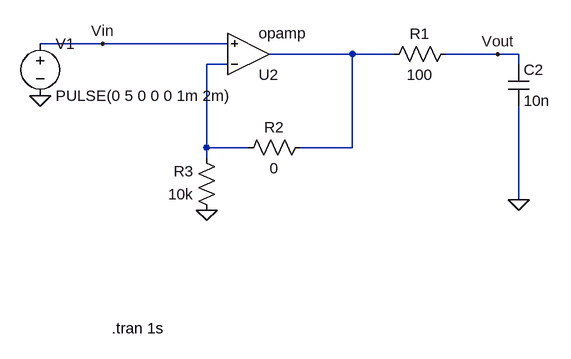
[diagram p0: schematic AnalogBuffer.asc]
AnalogBuffer.asc, the LTspice schematic file:
Version 4
SHEET 1 880 680
WIRE -128 -256 -224 -256
WIRE 64 -256 -128 -256
WIRE 256 -240 128 -240
WIRE 320 -240 256 -240
WIRE 480 -240 400 -240
WIRE 512 -240 480 -240
WIRE 64 -224 32 -224
WIRE 512 -224 512 -240
WIRE 32 -96 32 -224
WIRE 96 -96 32 -96
WIRE 256 -96 256 -240
WIRE 256 -96 176 -96
WIRE 32 -80 32 -96
WIRE 512 -16 512 -160
FLAG -224 -176 0
FLAG 512 -16 0
FLAG 32 0 0
FLAG -128 -256 Vin
FLAG 480 -240 Vout
SYMBOL res 416 -256 R90
WINDOW 0 0 56 VBottom 2
WINDOW 3 32 56 VTop 2
SYMATTR InstName R1
SYMATTR Value 100
SYMBOL opamp 96 -176 M180
SYMATTR InstName U2
SYMBOL voltage -224 -272 R0
WINDOW 123 0 0 Left 0
WINDOW 39 0 0 Left 0
SYMATTR InstName V1
SYMATTR Value PULSE(0 5 0 0 0 1m 2m)
SYMBOL res 192 -112 R90
WINDOW 0 0 56 VBottom 2
WINDOW 3 32 56 VTop 2
SYMATTR InstName R2
SYMATTR Value 0
SYMBOL res 48 16 R180
WINDOW 0 36 76 Left 2
WINDOW 3 36 40 Left 2
SYMATTR InstName R3
SYMATTR Value 10k
SYMBOL cap 496 -224 R0
SYMATTR InstName C2
SYMATTR Value 10n
TEXT -114 182 Left 2 !.tran 1s

The netlist it stands for:
* AnalogBuffer.asc
R1 Vout N001 100
XU2 N002 Vin N001 opamp Aol=100K GBW=10Meg  ; pins invin noninvin out
V1 Vin 0 PULSE(0 5 0 0 0 1m 2m)
R2 N001 N002 0
R3 0 N002 10k
C2 Vout 0 10n
.tran 1s
.backanno
.end